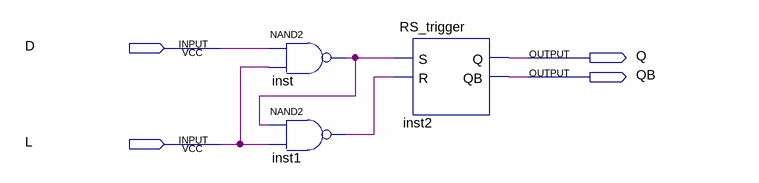
[diagram p0: schematic sheet]
// Quartus schematic D_trigger.bdf as structural Verilog: 3 symbols, 4 pins
module D_trigger (
  input  D,
  input  L,
  output Q,
  output QB
);

  wire inst1_out, inst_out;

  nand inst (inst_out, D, L);
  nand inst1 (inst1_out, inst_out, L);
  RS_trigger inst2 (.S(inst_out), .R(inst1_out), .Q(Q), .QB(QB));
endmodule
